# Altium schematic sheet IntelligentAccessControlSystem.SchDoc
size A4
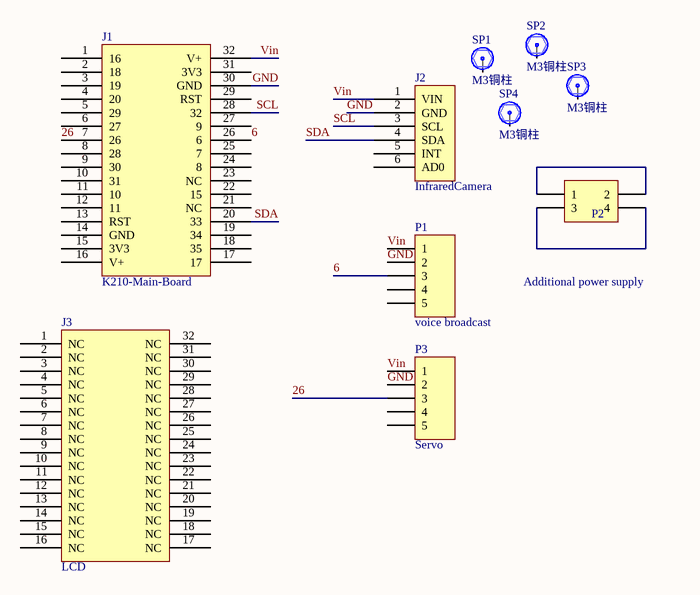
[diagram p0: IntelligentAccessControlSystem.SchDoc]

## Parts
J1  K210-Main-Board  [K210-Main-Board]
J2  InfraredCamera  [InfraredCamera]
J3  LCD  [LCD]
P1  voice broadcast  [HDR1X5]
P2  Additional power supply  [HDR2X2]
P3  Servo  [HDR1X5]
SP1  M3铜柱  [M3x4_L]
SP2  M3铜柱  [M3x4_L]
SP3  M3铜柱  [M3x4_L]
SP4  M3铜柱  [M3x4_L]

## Nets
6: J1.26(6) P1.3
26: J1.7(26) P3.3
GND: J1.30(GND) J2.2(GND) P1.2 P3.2
SCL: J1.28(32) J2.3(SCL)
SDA: J1.20(33) J2.4(SDA)
Vin: J1.32(V+) J2.1(VIN) P1.1 P3.1
NetP2_1: P2.1 P2.2
NetP2_3: P2.3 P2.4

Not connected (* = marked no-connect by the designer): J1 1(16) 2(18) 3(19) 4(20) 5(29) 6(27) 8(28) 9(30) 10(31) 11(10) 12(11) 13(RST) 14(GND) 15(3V3) 16(V+) 17 18(35) 19(34) 21(NC) 22(15) 23(NC) 24(8) 25(7) 27(9) 29(RST) 31(3V3); J2 5(INT) 6(AD0); J3 1(NC) 2(NC) 3(NC) 4(NC) 5(NC) 6(NC) 7(NC) 8(NC) 9(NC) 10(NC) 11(NC) 12(NC) 13(NC) 14(NC) 15(NC) 16(NC) 17(NC) 18(NC) 19(NC) 20(NC) 21(NC) 22(NC) 23(NC) 24(NC) 25(NC) 26(NC) 27(NC) 28(NC) 29(NC) 30(NC) 31(NC) 32(NC); P1 4 5; P3 4 5; SP1 1; SP2 1; SP3 1; SP4 1

## Library data of the parts
P1 P3 = Header 5: Header, 5-Pin; LatestRevisionDate: 17-Jul-2002; LatestRevisionNote: Re-released for DXP Platform.; Publisher: Altium Limited
P2 = Header 2X2: Header, 2-Pin, Dual row; LatestRevisionDate: 17-Jul-2002; LatestRevisionNote: Re-released for DXP Platform.; Publisher: Altium Limited
SP1-SP4 = 铜柱小焊盘: 铜柱; BOM名称: 铜柱